# EAGLE design Singularitron Laser Module (EAGLE 7.3.0)
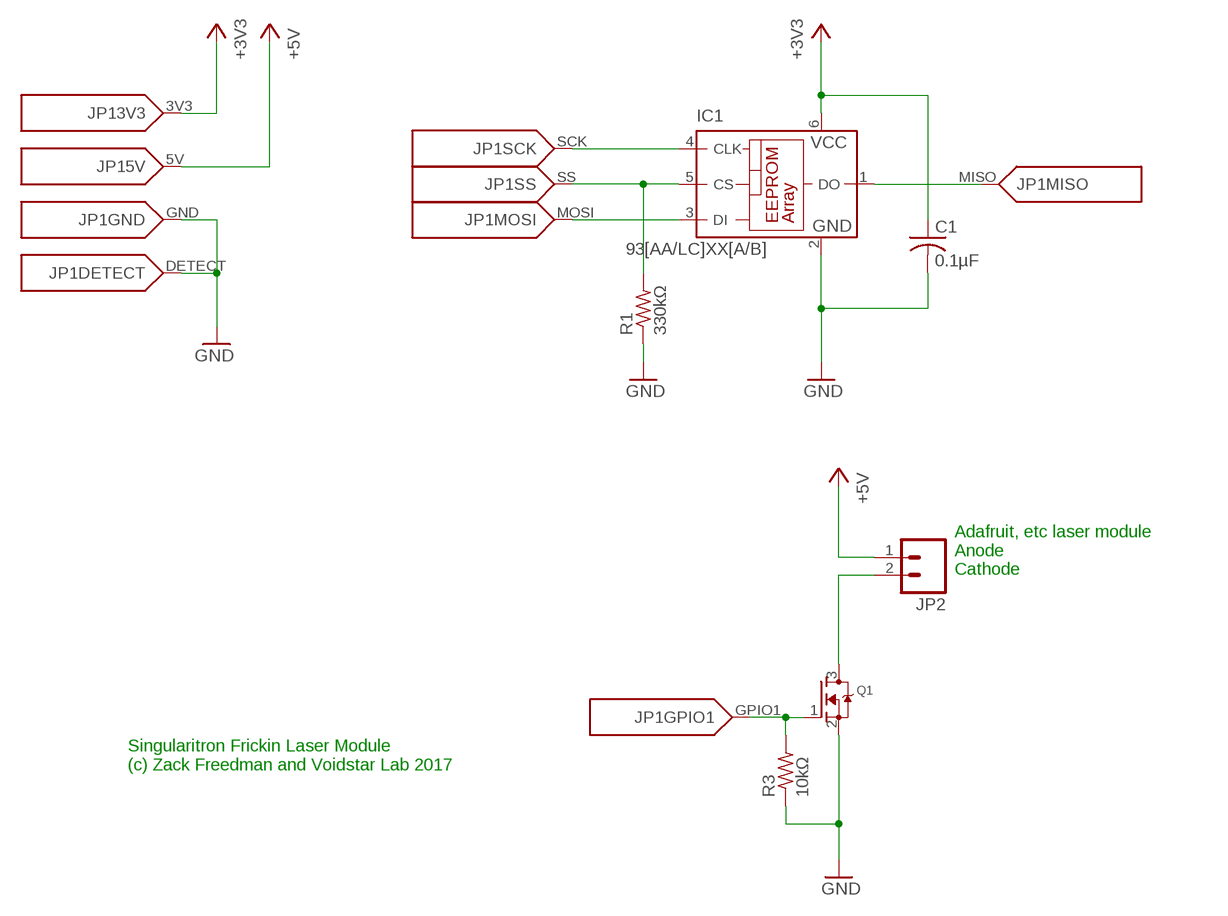
[diagram p0: schematic, sheet 1]

## Parts
C1  0.1µF  C-USC0603  [C0603]
IC1  93[AA/LC]XX[A/B]  93AA76A  [SOT23-6]
JP1  SINGULARITRON_CART_BASE  [SINGULARITRON_CART_BASE]
JP2  M02PTH  [1X02]
Q1  MOSFET-NREFLOW  [SOT23]
R1  330kΩ  R-US_R0603  [R0603]
R3  10kΩ  R-US_R0603  [R0603]

## Nets
+3V3: C1.1 IC1.6(VCC) JP1.3V3
+5V: JP1.5V JP2.1
GND: C1.2 IC1.2(GND) JP1.DETECT JP1.GND Q1.2(S) R1.1 R3.1
LASER: JP1.GPIO1 Q1.1(G) R3.2
N$1: IC1.5(CS) JP1.SS R1.2
N$5: IC1.4(CLK) JP1.SCK
N$6: IC1.3(DI) JP1.MOSI
N$7: IC1.1(DO) JP1.MISO
N$31: JP2.2 Q1.3(D)
Unconnected: JP1.GPIO2 JP1.SCL JP1.SDA

## Notes on the sheet
- Adafruit, etc laser module
  Anode
  Cathode
- Singularitron Frickin Laser Module
  (c) Zack Freedman and Voidstar Lab 2017

## Library data of the parts
C1 = rcl:C-US: CAPACITOR, American symbol
IC1 = microchip:93*76?: 8K Microwire Compatible Serial EEPROM Source: http://ww1.microchip.com/downloads/en/DeviceDoc/21796H.pdf; MPN: 93AA76AT-I/OT; OC_FARNELL: 1331443; OC_NEWARK: 35M2481
JP1 = Voidstar-Exotic:SINGULARITRON_CART_BASE
JP2 = SparkFun-Connectors:M02: Header 2 Standard 2-pin 0.1" header. Use with straight break away headers (SKU : PRT-00116), right angle break away headers (PRT-00553), swiss pins (PRT-00743), machine pins (PRT-00117), and female headers (PRT-00115). Molex polarized connector foot print use with SKU : PRT-08233 with associated crimp pins and housings.
Q1 = adafruit:MOSFET-N: N-Channel Mosfet 2N7002E - 60V 260mA SOT23 [Digikey: 2N7002ET1GOSTR-ND] - REEL BSH103 - 30V 850mA SOT23 [Digikey: 568-5013-1-ND]
R1 R3 = rcl:R-US_: RESISTOR, American symbol

## Board
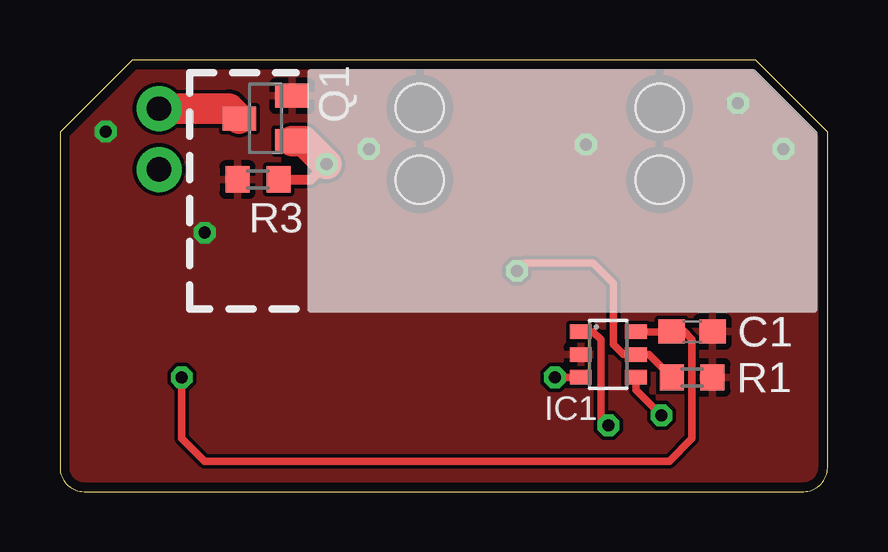
[diagram p1: board, top side]
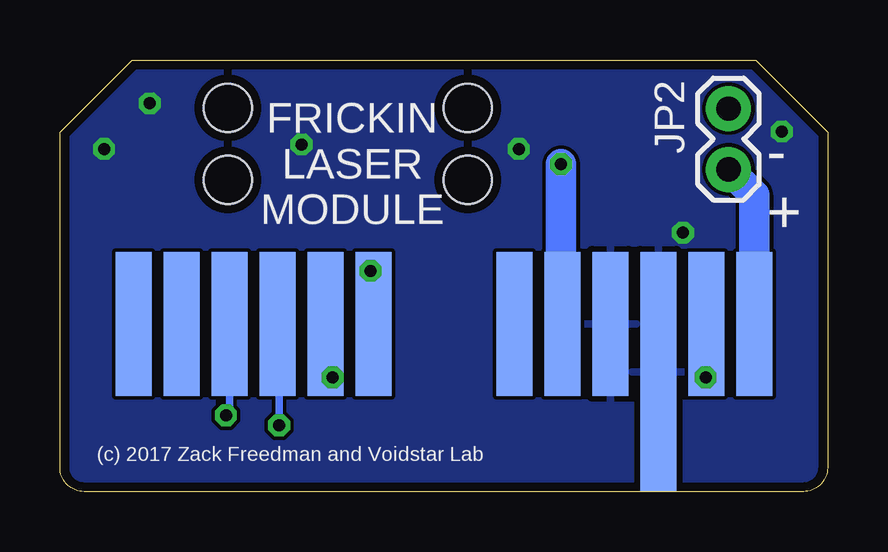
[diagram p2: board, bottom side, seen from below]

Size 32 x 18 mm. Coordinates in mm from the lower left corner, seen from the top.
Outline: 29,18 3,18 0,15 0,1 arc90 1,0 31,0 arc90 32,1 32,15 29,18
Copper layers (1*16): Top 0.035559375mm / dielectric 1.501140625mm / Bottom 0.035559375mm
Design rules "typical_4pcb *": minimum track width 10mil, minimum drill 15mil, track to track 6mil, track to pad 6mil, pad to pad 6mil, via to via 6mil, smd to smd 6mil, copper to edge 15mil, drill to drill 8mil, minimum pad ring 10mil, minimum via ring 8mil, stop-mask expansion 4mil, vias tented up to drill 20mil, thermal gap 10mil
Holes 2 mm at 15,16 15,13 25,13 25,16

### Footprints (pad centres in the part's own frame; a part is rotated, then mirrored left to right if it is on the bottom)
C0603 = smd 1.1 x 1: 1 -0.85,0; 2 0.85,0
SOT23-6 = smd 0.6 x 0.9: 1 -0.95,-1.15; 2 0,-1.15; 3 0.95,-1.15; 4 0.95,1.15; 5 0,1.15; 6 -0.95,1.15
SINGULARITRON_CART_BASE = smd 1.5 x 6 bottom: 3V3 5.062,7; 5V 3.062,7; DETECT 9.062,7; GPIO1 11.062,7; GPIO2 13.062,7; MISO 22.938,7; MOSI 20.938,7; SCK 24.938,7; SCL 28.938,7; SDA 26.938,7; SS 18.938,7 | smd 1.5 x 10 bottom: GND 7.062,5
1X02 = drill 1.016 pad 1.88: 1 0,0; 2 2.54,0
SOT23 = smd 1 x 1.4: 1 -0.95,-1.1; 2 0.95,-1.1; 3 0,1.1
R0603 = smd 1 x 1.1: 1 -0.85,0; 2 0.85,0

### Placement (x,y rotation side)
C1  26.35,6.67 0 top
IC1  22.86,5.71 270 top
JP1  0,0 0 top
JP2  4.13,13.43 90 bottom
Q1  8.57,15.56 90 top
R1  26.35,4.76 180 top
R3  8.26,13.02 0 top

### Tracks (layer width: path | path; a pad name or v marks a point on that pad's centre or on a via)
+3V3  (via drill 0.5)
  Top 0.305: 24.11,6.77 IC1.6 C1.1 26.04,6.67 26.35,6.35 26.35,2.22 25.4,1.27 6.03,1.27 5.08,2.22 v5.08,4.76
  Bottom 0.305: JP1.3V3 5.08,6.98 v5.08,4.76
+5V
  Bottom 1.27: JP2.1 3.06,12.37 JP1.5V
GND  (via drill 0.5)
  other vias: 6.03,10.79 21.92,14.48 28.26,16.19 30.16,14.29 1.91,15.02 12.88,14.29
  pour Top: 0,0 0,19.05 33.02,19.05 33.02,0
  pour Bottom: 0,0 0,19.05 33.02,19.05 33.02,0
LASER  (via drill 0.5)
  Top 0.406: R3.2 10.48,13.02 v11.11,13.65
  Top 1.27: Q1.1 10.16,14.61 v11.11,13.65
  Bottom 1.27: v11.11,13.65 11.11,7.05 JP1.GPIO1
N$1  (via drill 0.5)
  Top 0.305: v19.05,9.21 19.37,9.53 22.23,9.53 23.07,8.68 23.07,6.13 23.5,5.71 IC1.5 24.55,5.71 R1.2
  Bottom 0.305: JP1.SS 18.94,9.1 v19.05,9.21
N$5  (via drill 0.5)
  Top 0.305: IC1.4 24.01,4.25 v25.08,3.17
  Bottom 0.305: JP1.SCK 24.94,3.32 v25.08,3.17
N$6  (via drill 0.5)
  Top 0.305: IC1.3 v20.64,4.76
  Bottom 0.305: JP1.MOSI 20.94,5.06 v20.64,4.76
N$7  (via drill 0.5)
  Top 0.305: IC1.1 22.23,6.67 22.54,6.35 22.54,3.08 v22.86,2.76
  Bottom 0.305: JP1.MISO 22.86,6.92 v22.86,2.76
N$31
  Top 1.27: JP2.2 7.06,15.97 Q1.3

### Text on the board
bPlace: FRICKIN / LASER / MODULE | - | + | (c) 2017 Zack Freedman and Voidstar Lab